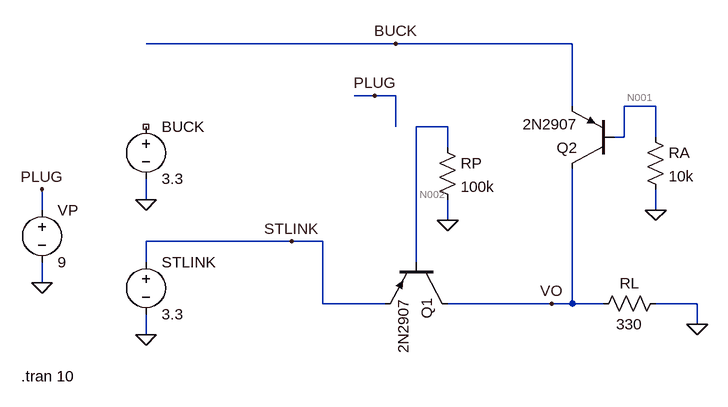
[diagram p0: schematic A3.asc]
A3.asc, the LTspice schematic file:
Version 4
SHEET 1 932 680
WIRE 448 -64 64 -64
WIRE 720 -64 448 -64
WIRE 416 16 384 16
WIRE 448 16 416 16
WIRE 720 32 720 -64
WIRE 848 32 800 32
WIRE 448 64 448 16
WIRE 528 64 480 64
WIRE 800 80 800 32
WIRE 800 80 784 80
WIRE 848 80 848 32
WIRE 528 96 528 64
WIRE 64 176 64 144
WIRE -96 192 -96 160
WIRE 848 192 848 160
WIRE 528 208 528 176
WIRE 288 240 64 240
WIRE 336 240 288 240
WIRE 64 272 64 240
WIRE 480 272 480 64
WIRE -96 304 -96 272
WIRE 336 336 336 240
WIRE 432 336 336 336
WIRE 688 336 528 336
WIRE 720 336 720 128
WIRE 720 336 688 336
WIRE 768 336 720 336
WIRE 912 336 848 336
WIRE 912 368 912 336
WIRE 64 384 64 352
FLAG -96 304 0
FLAG 64 384 0
FLAG 64 176 0
FLAG 912 368 0
FLAG -96 160 PLUG
FLAG 528 208 0
FLAG 416 16 PLUG
FLAG 848 192 0
FLAG 688 336 VO
FLAG 448 -64 BUCK
FLAG 288 240 STLINK
SYMBOL voltage 64 48 R0
WINDOW 123 0 0 Left 0
WINDOW 39 0 0 Left 0
SYMATTR InstName BUCK
SYMATTR Value 3.3
SYMBOL voltage 64 256 R0
WINDOW 123 0 0 Left 0
WINDOW 39 0 0 Left 0
SYMATTR InstName STLINK
SYMATTR Value 3.3
SYMBOL voltage -96 176 R0
WINDOW 123 0 0 Left 0
WINDOW 39 0 0 Left 0
SYMATTR InstName VP
SYMATTR Value 9
SYMBOL res 864 320 R90
WINDOW 0 0 56 VBottom 2
WINDOW 3 32 56 VTop 2
SYMATTR InstName RL
SYMATTR Value 330
SYMBOL res 512 80 R0
SYMATTR InstName RP
SYMATTR Value 100k
SYMBOL res 832 64 R0
SYMATTR InstName RA
SYMATTR Value 10k
SYMBOL pnp 528 272 R90
SYMATTR InstName Q1
SYMATTR Value 2N2907
SYMBOL pnp 784 128 R180
SYMATTR InstName Q2
SYMATTR Value 2N2907
TEXT -128 448 Left 2 !.tran 10

The netlist it stands for:
* A3.asc
V§BUCK NC_01 0 3.3
V§STLINK STLINK 0 3.3
VP PLUG 0 9
RL 0 VO 330
RP N002 0 100k
RA N001 0 10k
Q1 VO N002 STLINK 0 2N2907
Q2 VO N001 BUCK 0 2N2907
.model NPN NPN
.model PNP PNP
.lib standard.bjt
.tran 10
.backanno
.end

* Results of the author's LTspice run, read from the files saved beside the schematic
* Operating Point, zero values left out:
*   V(stlink) = 3.3 V
*   V(plug) = 9 V
*   V(vo) = 2.059 V
*   V(n002) = 2.595 V
*   V(n001) = 1.425 V
*   V(buck) = 2.059 V
*   Ic(Q1) = -6.381 mA
*   Ib(Q1) = -25.95 µA
*   Ie(Q1) = 6.407 mA
*   Ic(Q2) = 142.5 µA
*   Ib(Q2) = -142.5 µA
*   I(Rl) = -6.239 mA
*   I(Rp) = 25.95 µA
*   I(Ra) = 142.5 µA
*   I(Stlink) = -6.407 mA